# Altium project Milk_boiler.PrjPcb
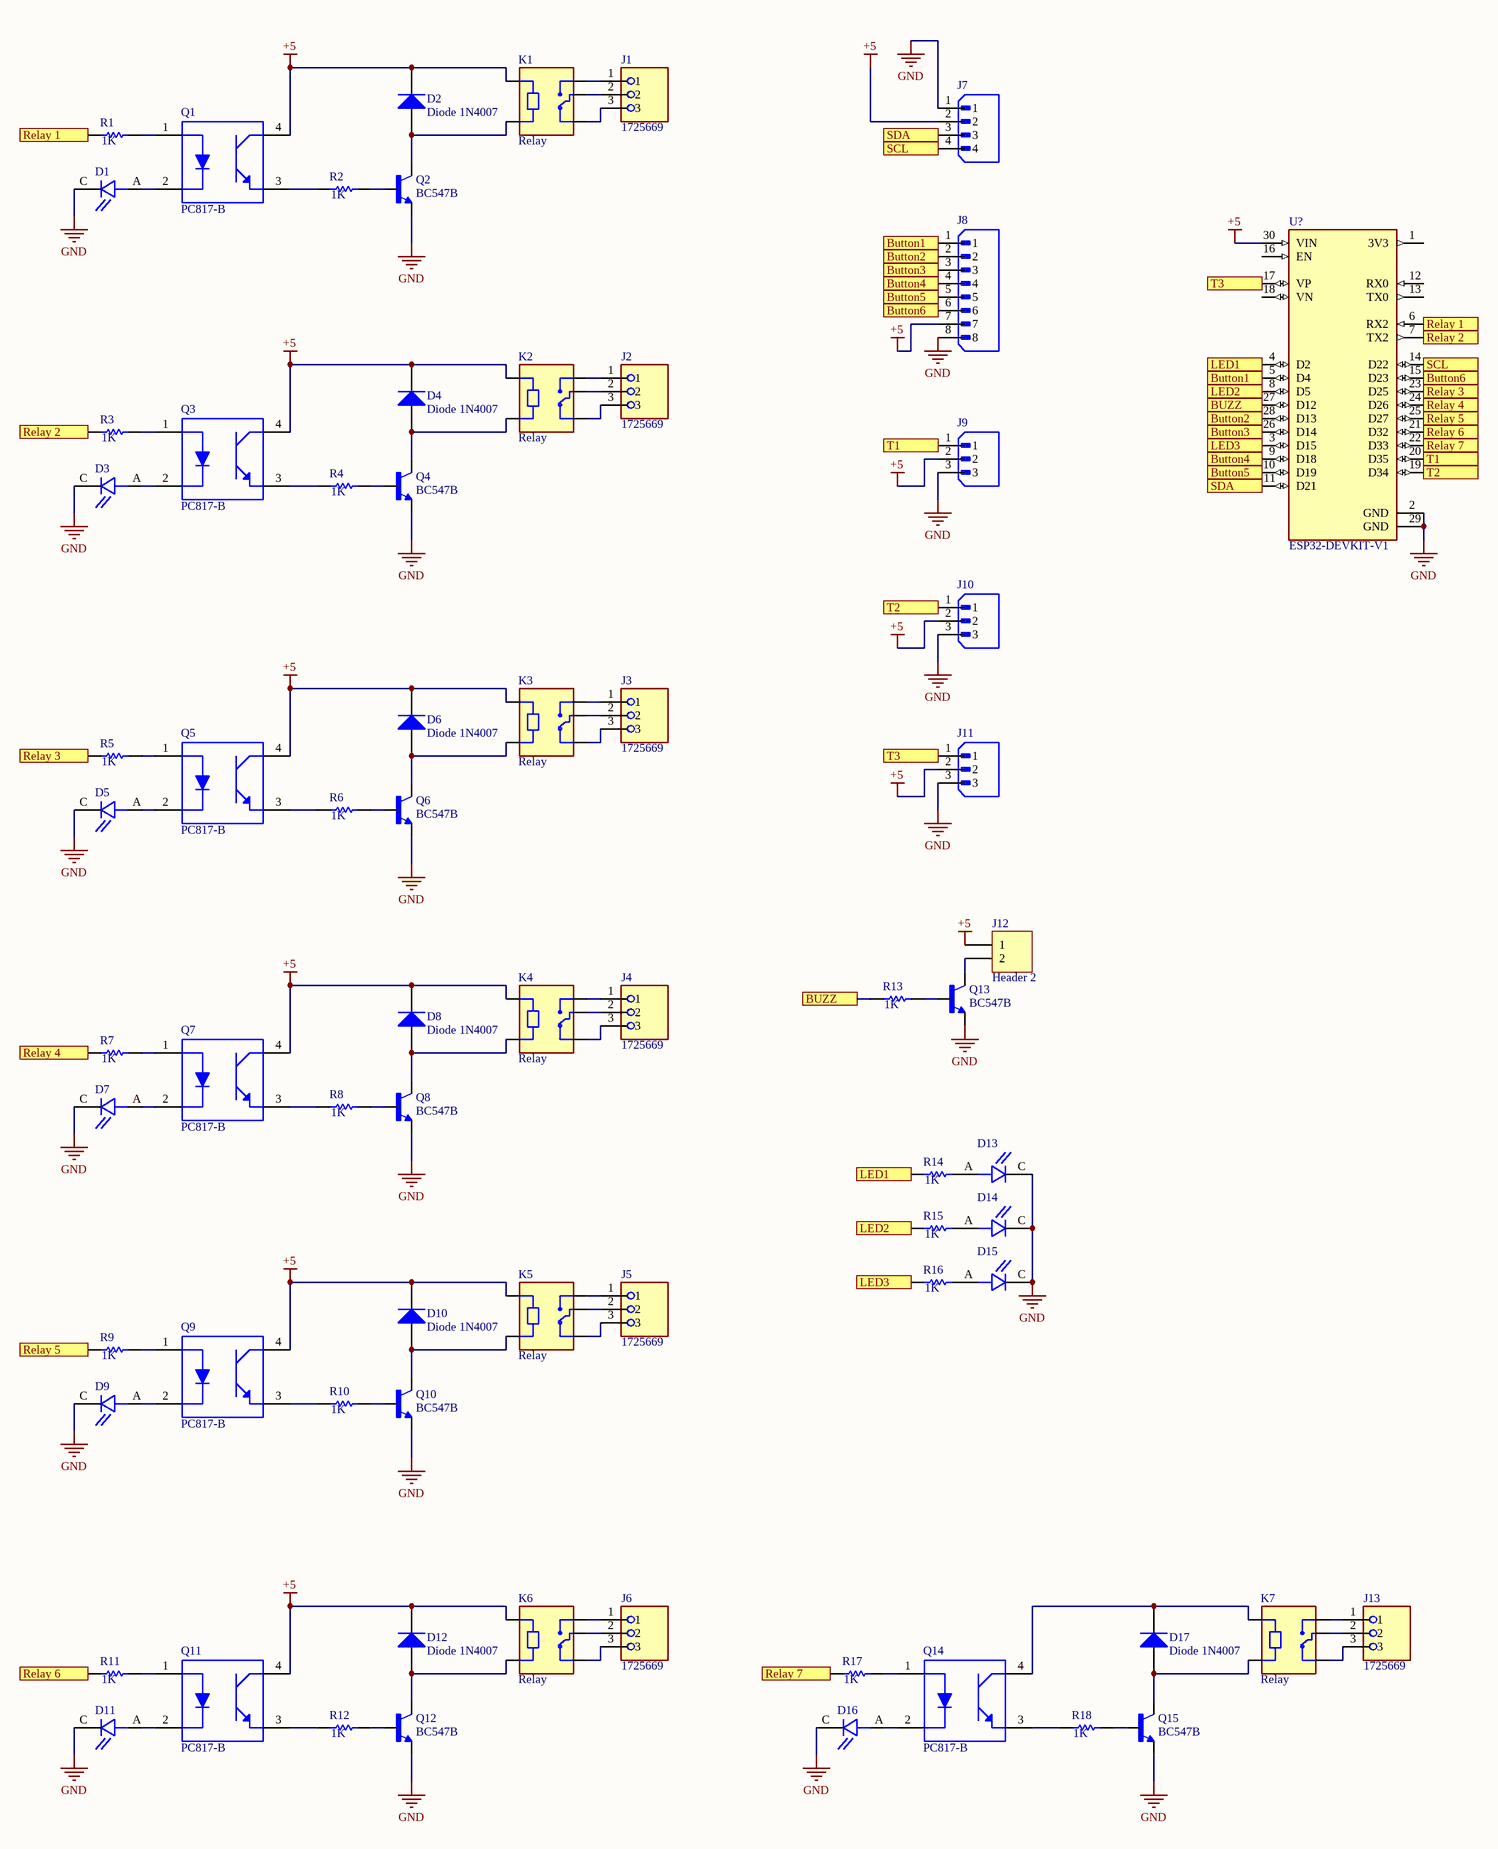
[diagram p0: Sheet1.SchDoc]
1 sheet, 71 parts. Net scope: flat (ports and power ports of the same name join across sheets).

## Sheet Sheet1.SchDoc
size C

### Parts
D1  OVLAW4CB7  [LEDRD254W50D305H520P]  (value not drawn)
D2  Diode 1N4007  [DO-41]
D3  OVLAW4CB7  [LEDRD254W50D305H520P]  (value not drawn)
D4  Diode 1N4007  [DO-41]
D5  OVLAW4CB7  [LEDRD254W50D305H520P]  (value not drawn)
D6  Diode 1N4007  [DO-41]
D7  OVLAW4CB7  [LEDRD254W50D305H520P]  (value not drawn)
D8  Diode 1N4007  [DO-41]
D9  OVLAW4CB7  [LEDRD254W50D305H520P]  (value not drawn)
D10  Diode 1N4007  [DO-41]
D11  OVLAW4CB7  [LEDRD254W50D305H520P]  (value not drawn)
D12  Diode 1N4007  [DO-41]
D13  OVLAW4CB7  [LEDRD254W50D305H520P]  (value not drawn)
D14  OVLAW4CB7  [LEDRD254W50D305H520P]  (value not drawn)
D15  OVLAW4CB7  [LEDRD254W50D305H520P]  (value not drawn)
D16  OVLAW4CB7  [LEDRD254W50D305H520P]  (value not drawn)
D17  Diode 1N4007  [DO-41]
J1  1725669  [PHOENIX_1725669]
J2  1725669  [PHOENIX_1725669]
J3  1725669  [PHOENIX_1725669]
J4  1725669  [PHOENIX_1725669]
J5  1725669  [PHOENIX_1725669]
J6  1725669  [PHOENIX_1725669]
J7  B4B-XH-A(LF)(SN)  [JST_B4B-XH-A(LF)(SN)]  (value not drawn)
J8  B8B-XH-A  [JST_B8B-XH-A]  (value not drawn)
J9  B3B-XH-A  [JST_B3B-XH-A]  (value not drawn)
J10  B3B-XH-A  [JST_B3B-XH-A]  (value not drawn)
J11  B3B-XH-A  [JST_B3B-XH-A]  (value not drawn)
J12  Header 2  [HDR1X2]
J13  1725669  [PHOENIX_1725669]
K1  Relay  [RELAY_SRD-05VDC-SL-C]
K2  Relay  [RELAY_SRD-05VDC-SL-C]
K3  Relay  [RELAY_SRD-05VDC-SL-C]
K4  Relay  [RELAY_SRD-05VDC-SL-C]
K5  Relay  [RELAY_SRD-05VDC-SL-C]
K6  Relay  [RELAY_SRD-05VDC-SL-C]
K7  Relay  [RELAY_SRD-05VDC-SL-C]
Q1  PC817-B  [DIP762W50P254L650H455Q4B]
Q2  BC547B  [TO92250P510H770-3]
Q3  PC817-B  [DIP762W50P254L650H455Q4B]
Q4  BC547B  [TO92250P510H770-3]
Q5  PC817-B  [DIP762W50P254L650H455Q4B]
Q6  BC547B  [TO92250P510H770-3]
Q7  PC817-B  [DIP762W50P254L650H455Q4B]
Q8  BC547B  [TO92250P510H770-3]
Q9  PC817-B  [DIP762W50P254L650H455Q4B]
Q10  BC547B  [TO92250P510H770-3]
Q11  PC817-B  [DIP762W50P254L650H455Q4B]
Q12  BC547B  [TO92250P510H770-3]
Q13  BC547B  [TO92250P510H770-3]
Q14  PC817-B  [DIP762W50P254L650H455Q4B]
Q15  BC547B  [TO92250P510H770-3]
R1  value 1K  [AXIAL-0.3]  (hidden comment: Res1)
R2  value 1K  [AXIAL-0.3]  (hidden comment: Res1)
R3  value 1K  [AXIAL-0.3]  (hidden comment: Res1)
R4  value 1K  [AXIAL-0.3]  (hidden comment: Res1)
R5  value 1K  [AXIAL-0.3]  (hidden comment: Res1)
R6  value 1K  [AXIAL-0.3]  (hidden comment: Res1)
R7  value 1K  [AXIAL-0.3]  (hidden comment: Res1)
R8  value 1K  [AXIAL-0.3]  (hidden comment: Res1)
R9  value 1K  [AXIAL-0.3]  (hidden comment: Res1)
R10  value 1K  [AXIAL-0.3]  (hidden comment: Res1)
R11  value 1K  [AXIAL-0.3]  (hidden comment: Res1)
R12  value 1K  [AXIAL-0.3]  (hidden comment: Res1)
R13  value 1K  [AXIAL-0.3]  (hidden comment: Res1)
R14  value 1K  [AXIAL-0.3]  (hidden comment: Res1)
R15  value 1K  [AXIAL-0.3]  (hidden comment: Res1)
R16  value 1K  [AXIAL-0.3]  (hidden comment: Res1)
R17  value 1K  [AXIAL-0.3]  (hidden comment: Res1)
R18  value 1K  [AXIAL-0.3]  (hidden comment: Res1)
U?  ESP32-DEVKIT-V1  [MODULE_ESP32_DEVKIT_V1]

### Ports
Button1, Button2, Button3, Button4, Button5, Button6, BUZZ, LED1, LED2, LED3, Relay 1, Relay 2, Relay 3, Relay 4, Relay 5, Relay 6, Relay 7, SCL, SDA, T1, T2, T3

### Nets
+5: D2.2(K) D4.2(K) D6.2(K) D8.2(K) D10.2(K) D12.2(K) J7.2 J8.7 J9.2 J10.2 J11.2 J12.1 K1.A1 K2.A1 K3.A1 K4.A1 K5.A1 K6.A1 Q1.4(COLLECTOR) Q3.4(COLLECTOR) Q5.4(COLLECTOR) Q7.4(COLLECTOR) Q9.4(COLLECTOR) Q11.4(COLLECTOR) U?.30(VIN)
GND: D1.C D3.C D5.C D7.C D9.C D11.C D13.C D14.C D15.C D16.C J7.1 J8.8 J9.3 J10.3 J11.3 Q2.3(E) Q4.3(E) Q6.3(E) Q8.3(E) Q10.3(E) Q12.3(E) Q13.3(E) Q15.3(E) U?.2(GND) U?.29(GND)
NetD1_A: D1.A Q1.2(CATHODE)
NetD2_1: D2.1(A) K1.A2 Q2.1(C)
NetD3_A: D3.A Q3.2(CATHODE)
NetD4_1: D4.1(A) K2.A2 Q4.1(C)
NetD5_A: D5.A Q5.2(CATHODE)
NetD6_1: D6.1(A) K3.A2 Q6.1(C)
NetD7_A: D7.A Q7.2(CATHODE)
NetD8_1: D8.1(A) K4.A2 Q8.1(C)
NetD9_A: D9.A Q9.2(CATHODE)
NetD10_1: D10.1(A) K5.A2 Q10.1(C)
NetD11_A: D11.A Q11.2(CATHODE)
NetD12_1: D12.1(A) K6.A2 Q12.1(C)
NetD13_A: D13.A R14.2
NetD14_A: D14.A R15.2
NetD15_A: D15.A R16.2
NetD16_A: D16.A Q14.2(CATHODE)
NetD17_1: D17.1(A) K7.A2 Q15.1(C)
NetD17_2: D17.2(K) K7.A1 Q14.4(COLLECTOR)
NetJ1_1: J1.1 K1.NO
NetJ1_2: J1.2 K1.COM
NetJ1_3: J1.3 K1.NC
NetJ2_1: J2.1 K2.NO
NetJ2_2: J2.2 K2.COM
NetJ2_3: J2.3 K2.NC
NetJ3_1: J3.1 K3.NO
NetJ3_2: J3.2 K3.COM
NetJ3_3: J3.3 K3.NC
NetJ4_1: J4.1 K4.NO
NetJ4_2: J4.2 K4.COM
NetJ4_3: J4.3 K4.NC
NetJ5_1: J5.1 K5.NO
NetJ5_2: J5.2 K5.COM
NetJ5_3: J5.3 K5.NC
NetJ6_1: J6.1 K6.NO
NetJ6_2: J6.2 K6.COM
NetJ6_3: J6.3 K6.NC
NetJ7_3: J7.3 U?.11(D21) ; port SDA
NetJ7_4: J7.4 U?.14(D22) ; port SCL
NetJ8_1: J8.1 U?.5(D4) ; port Button1
NetJ8_2: J8.2 U?.28(D13) ; port Button2
NetJ8_3: J8.3 U?.26(D14) ; port Button3
NetJ8_4: J8.4 U?.9(D18) ; port Button4
NetJ8_5: J8.5 U?.10(D19) ; port Button5
NetJ8_6: J8.6 U?.15(D23) ; port Button6
NetJ9_1: J9.1 U?.20(D35) ; port T1
NetJ10_1: J10.1 U?.19(D34) ; port T2
NetJ11_1: J11.1 U?.17(VP) ; port T3
NetJ12_2: J12.2 Q13.1(C)
NetJ13_1: J13.1 K7.NO
NetJ13_2: J13.2 K7.COM
NetJ13_3: J13.3 K7.NC
NetQ1_1: Q1.1(ANODE) R1.2
NetQ1_3: Q1.3(EMITTER) R2.1
NetQ2_2: Q2.2(B) R2.2
NetQ3_1: Q3.1(ANODE) R3.2
NetQ3_3: Q3.3(EMITTER) R4.1
NetQ4_2: Q4.2(B) R4.2
NetQ5_1: Q5.1(ANODE) R5.2
NetQ5_3: Q5.3(EMITTER) R6.1
NetQ6_2: Q6.2(B) R6.2
NetQ7_1: Q7.1(ANODE) R7.2
NetQ7_3: Q7.3(EMITTER) R8.1
NetQ8_2: Q8.2(B) R8.2
NetQ9_1: Q9.1(ANODE) R9.2
NetQ9_3: Q9.3(EMITTER) R10.1
NetQ10_2: Q10.2(B) R10.2
NetQ11_1: Q11.1(ANODE) R11.2
NetQ11_3: Q11.3(EMITTER) R12.1
NetQ12_2: Q12.2(B) R12.2
NetQ13_2: Q13.2(B) R13.2
NetQ14_1: Q14.1(ANODE) R17.2
NetQ14_3: Q14.3(EMITTER) R18.1
NetQ15_2: Q15.2(B) R18.2
NetR1_1: R1.1 U?.6(RX2) ; port Relay 1
NetR3_1: R3.1 U?.7(TX2) ; port Relay 2
NetR5_1: R5.1 U?.23(D25) ; port Relay 3
NetR7_1: R7.1 U?.24(D26) ; port Relay 4
NetR9_1: R9.1 U?.25(D27) ; port Relay 5
NetR11_1: R11.1 U?.21(D32) ; port Relay 6
NetR13_1: R13.1 U?.27(D12) ; port BUZZ
NetR14_1: R14.1 U?.4(D2) ; port LED1
NetR15_1: R15.1 U?.8(D5) ; port LED2
NetR16_1: R16.1 U?.3(D15) ; port LED3
NetR17_1: R17.1 U?.22(D33) ; port Relay 7

Not connected (* = marked no-connect by the designer): U? 1(3V3) 12(RX0) 13(TX0) 16(EN) 18(VN)

### Library data of the parts
D1 D3 D5 D7 D9 D11 D13-D16 = OVLAW4CB7: White LED Indication - Discrete 3.2V Radial; MF: TT Electronics/Optek; Value: *; SnapEDA_Link: https://www.snapeda.com/parts/OVLAW4CB7/TT%20Electronics/Optek%20Technology/view-part/328075/?ref=snap; Availability: Unavailable; Package: Radial Optek; Price: None; MP: OVLAW4CB7
D2 D4 D6 D8 D10 D12 D17 = Diode 1N4007: 1 Amp General Purpose Rectifier; Published: 8-Jun-2000; LatestRevisionDate: 17-Jul-2002; LatestRevisionNote: Re-released for DXP Platform.; DatasheetVersion: 1998; PackageVersion: Aug-1999; PackageReference: DO-41; Publisher: Altium Limited; PackageDescription: Diode, Axial; Body 5.2 x 2.7 mm (LxDia. max), Lead Dia. 0.86 mm (max); Code_JEDEC: DO-204-AL; ComponentLink1Description: Manufacturer Link; ComponentLink1URL: http://www.fairchildsemi.com/; ComponentLink2Description: Datasheet; ComponentLink2URL: http://www.fairchildsemi.com/ds/1N%2F1N4001.pdf
J1-J6 J13 = 1725669: Vis de borne PCB 2,54 mm 20AWG 160V 6A 3 positions COMBICON MPT Series ¦ PhÃ©nix Contacter 1725669; MF: Phoenix Contact; SnapEDA_Link: https://www.snapeda.com/parts/1725669/Phoenix+Contact/view-part/?ref=snap; Package: None; Value: *; MP: 1725669; Check_prices: https://www.snapeda.com/parts/1725669/Phoenix+Contact/view-part/?ref=eda
J7 = B4B-XH-A(LF)(SN): Connector Header Through Hole 4 position 0.098 (2.50mm); MF: JST Sales; SnapEDA_Link: https://www.snapeda.com/parts/B4B-XH-A(LF)(SN)/JST+Sales+America+Inc./view-part/?ref=snap; Package: None; Value: *; MP: B4B-XH-A(LF)(SN); Check_prices: https://www.snapeda.com/parts/B4B-XH-A(LF)(SN)/JST+Sales+America+Inc./view-part/?ref=eda
J8 = B8B-XH-A: Connector Header Through Hole 8 position 0.098 (2.50mm); MF: JST; SnapEDA_Link: https://www.snapeda.com/parts/B8B-XH-A/JST/view-part/?ref=snap; Package: None; Value: *; MP: B8B-XH-A; Check_prices: https://www.snapeda.com/parts/B8B-XH-A/JST/view-part/?ref=eda
J9-J11 = B3B-XH-A: Connector Header Through Hole 3 position 0.098 (2.50mm); MF: JST Sales; SnapEDA_Link: https://www.snapeda.com/parts/B3B-XH-A/JST+Sales+America+Inc./view-part/?ref=snap; Package: None; Value: *; MP: B3B-XH-A; Check_prices: https://www.snapeda.com/parts/B3B-XH-A/JST+Sales+America+Inc./view-part/?ref=eda
J12 = Header 2: Header, 2-Pin; LatestRevisionDate: 17-Jul-2002; LatestRevisionNote: Re-released for DXP Platform.; Publisher: Altium Limited
K1-K7 = SRD-05VDC-SL-C: 5V Trigger Relay Module For Arduino And Raspberry Pi 5V Trigger Relay Module For Arduino And Raspberry Pi; MF: Songle Relay; Check_prices: https://www.snapeda.com/parts/SRD-05VDC-SL-C/Songle+Relay/view-part/?ref=eda; Value: *; Availability: Not in stock; Price: None; Package: NON STANDARD-5 Songle Relay; MP: SRD-05VDC-SL-C; SnapEDA_Link: https://www.snapeda.com/parts/SRD-05VDC-SL-C/Songle+Relay/view-part/?ref=snap
Q1 Q3 Q5 Q7 Q9 Q11 Q14 = PC817-B: Phototransistors 4-DIP _0.300, 7.62mm_; MF: American Bright; SnapEDA_Link: https://www.snapeda.com/parts/PC817-B/American%20Bright/view-part/524587/?ref=snap; Availability: Unavailable; MP: PC817-B; Value: *; Price: None; Package: DIP-4 American Bright
Q2 Q4 Q6 Q8 Q10 Q12 Q13 Q15 = BC547B: Bipolar (BJT) TransistÃ¶r NPN 45 V 100 mA 300MHz 625 mW Delikten TO-92 (TO-226); MF: ON Semiconductor; SnapEDA_Link: https://www.snapeda.com/parts/BC547B/Onsemi/view-part/?ref=snap; MP: BC547B; Availability: In Stock; Price: None; Value: *; Check_prices: https://www.snapeda.com/parts/BC547B/Onsemi/view-part/?ref=eda; Package: TO-92-3 ON Semiconductor; Purchase-URL: https://pricing.snapeda.com/search/part/BC547B/?ref=eda
R1-R18 = Res1: Resistor; Published: 8-Jun-2000; LatestRevisionDate: 17-Jul-2002; LatestRevisionNote: Re-released for DXP Platform.; PackageReference: AXIAL-0.3; Publisher: Altium Limited; PackageDescription: Axial Device, Thru-Hole; 2 Leads; 0.3 in Pin Spacing
U? = ESP32-DEVKIT-V1: Dual core, Wi-Fi: 2.4 GHz up to 150 Mbits/s,BLE (Bluetooth Low Energy) and legacy Bluetooth, 32 bits, Up to 240 MHz; MF: Do it; Price: None; Availability: Not in stock; Package: None; MP: ESP32-DEVKIT-V1; Value: *; SnapEDA_Link: https://www.snapeda.com/parts/ESP32-DEVKIT-V1/Do+it/view-part/?ref=snap; Check_prices: https://www.snapeda.com/parts/ESP32-DEVKIT-V1/Do+it/view-part/?ref=eda